# Altium project UltraZOhm_CarrierBoard.PrjPcb (part 3 of 8)

## Sheet ETH-PHY.SchDoc
size A4; Author: A. Geiger & E. Liegmann; CompanyName: Technische Hochschule Nürnberg Georg Simon Ohm; Organization: UltraZohm; Address1: Kesslerplatz 12; Address2: 90489 Nürnberg; Address3: GERMANY; SheetNumber: 30; Website: www.ultrazohm.com
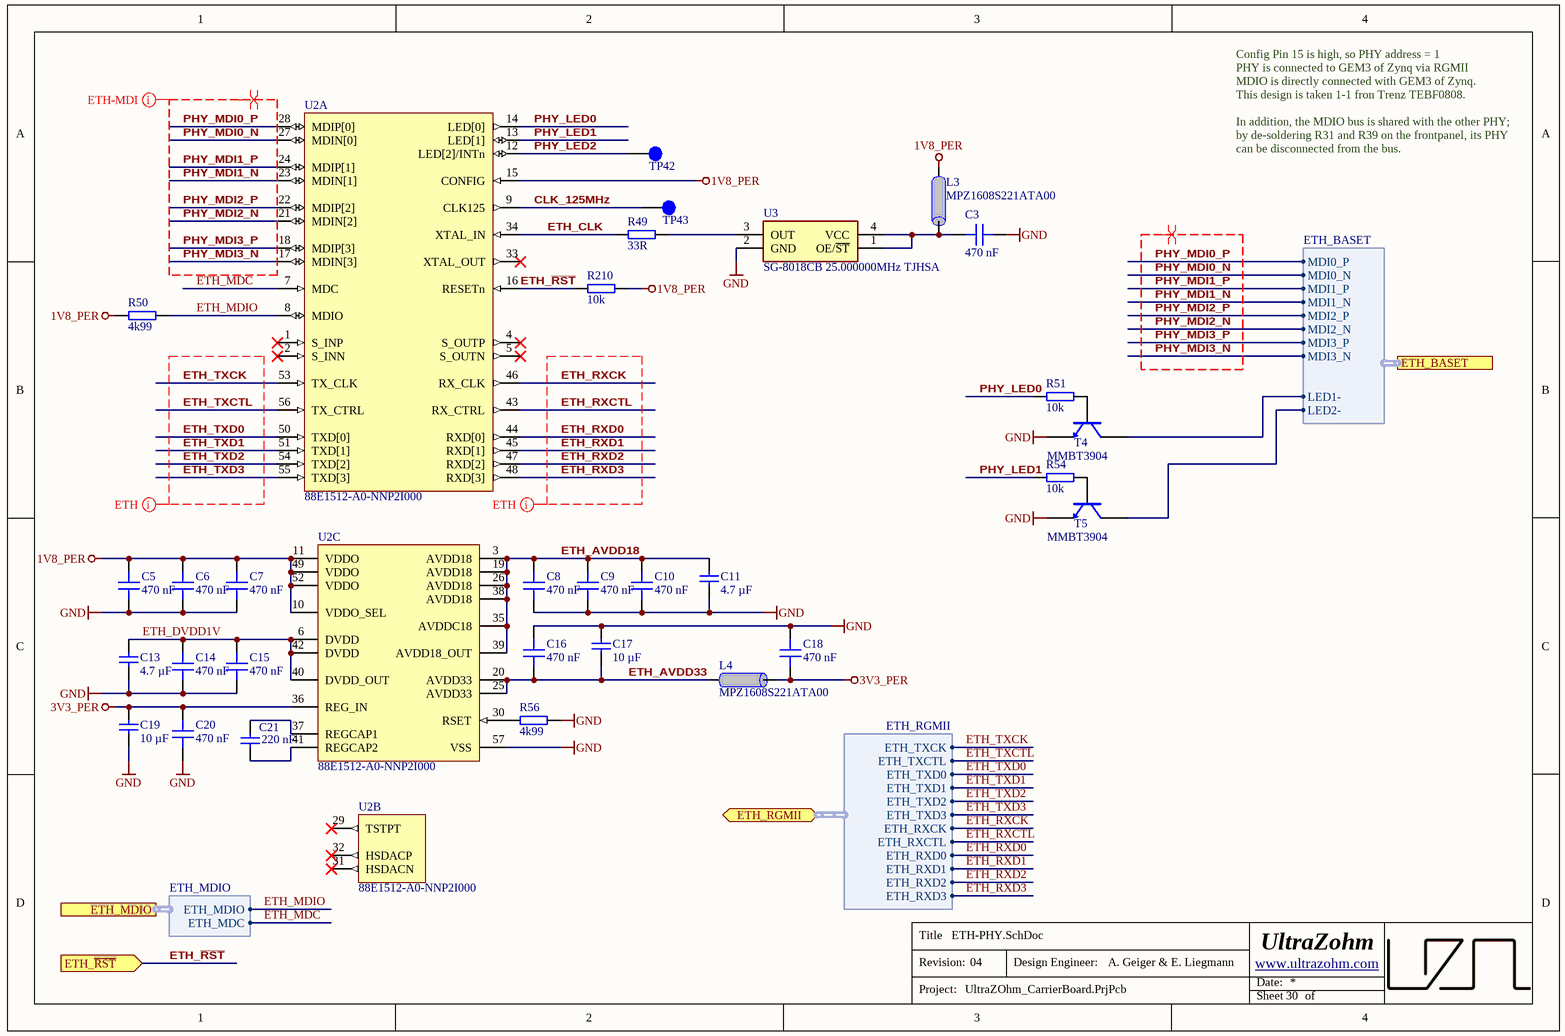
[diagram p5: ETH-PHY.SchDoc]

### Parts
C3  470 nF  [C_0603_TE]
C5  470 nF  [C_0603_TE]
C6  470 nF  [C_0603_TE]
C7  470 nF  [C_0603_TE]
C8  470 nF  [C_0603_TE]
C9  470 nF  [C_0603_TE]
C10  470 nF  [C_0603_TE]
C11  4.7 µF  [C_0603_TE]
C13  4.7 µF  [C_0603_TE]
C14  470 nF  [C_0603_TE]
C15  470 nF  [C_0603_TE]
C16  470 nF  [C_0603_TE]
C17  10 µF  [C_0603_TE]
C18  470 nF  [C_0603_TE]
C19  10 µF  [C_0603_TE]
C20  470 nF  [C_0603_TE]
C21  220 nF  [C_0603_TE]
L3  MPZ1608S221ATA00  [RES 0603_1608]
L4  MPZ1608S221ATA00  [RES 0603_1608]
R49  33R  [R_0603_TE]
R50  4k99  [RES 0603_1608]
R51  10k  [R_0603_TE]
R54  10k  [R_0603_TE]
R56  4k99  [RES 0603_1608]
R210  10k  [R_0603_TE]
T4  MMBT3904  [SOT95P280X145-3N]
T5  MMBT3904  [SOT95P280X145-3N]
TP42  Testpoint 1mm  [TP_1mm]  (value not drawn)  (no BOM)
TP43  Testpoint 1mm  [TP_1mm]  (value not drawn)  (no BOM)
U2  88E1512-A0-NNP2I000  [QFN50P800X800X100-57N]  (parts A,B,C of 3)
U3  SG-8018CB 25.000000MHz TJHSA  [SMD5032-4P]

### Ports
ETH_BASET (harness ETH_BASET), ETH_MDIO (harness ETH_MDIO), ETH_RGMII (bidir, harness ETH_RGMII), ETH_~{RST} (in)

### Harnesses
ETH_RGMII: ETH_TXCK, ETH_TXCTL, ETH_TXD0, ETH_TXD1, ETH_TXD2, ETH_TXD3, ETH_RXCK, ETH_RXCTL, ETH_RXD0, ETH_RXD1, ETH_RXD2, ETH_RXD3
ETH_MDIO: ETH_MDC, ETH_MDIO
ETH_BASET: MDI0_P, MDI0_N, MDI1_P, MDI1_N, MDI2_P, MDI2_N, MDI3_P, MDI3_N, LED1-, LED2-

### Nets
1V8_PER: C5.1 C6.1 C7.1 L3.1 R50.1 R210.2 U2.10(VDDO_SEL) U2.11(VDDO) U2.15(CONFIG) U2.49(VDDO) U2.52(VDDO)
3V3_PER: C18.2 C19.1 C20.1 L4.2 U2.36(REG_IN)
GND: C3.1 C5.2 C6.2 C7.2 C8.2 C9.2 C10.2 C11.2 C13.2 C14.2 C15.2 C16.1 C17.1 C18.1 C19.2 C20.2 R56.2 T4.2(EMITTER) T5.2(EMITTER) U2.57(VSS) U3.2(GND)
CLK_125MHz: TP43.1 U2.9(CLK125)
ETH_AVDD18: C8.1 C9.1 C10.1 C11.1 U2.3(AVDD18) U2.19(AVDD18) U2.26(AVDD18) U2.35(AVDDC18) U2.38(AVDD18) U2.39(AVDD18_OUT)
ETH_AVDD33: C16.2 C17.2 L4.1 U2.20(AVDD33) U2.25(AVDD33)
ETH_CLK: R49.1 U2.34(XTAL_IN)
ETH_DVDD1V: C13.1 C14.1 C15.1 U2.6(DVDD) U2.40(DVDD_OUT) U2.42(DVDD)
ETH_MDC: U2.7(MDC) ; port ETH_MDIO.ETH_MDC
ETH_MDIO: R50.2 U2.8(MDIO) ; port ETH_MDIO.ETH_MDIO
ETH_~{RST}: R210.1 U2.16(RESETn) ; port ETH_~{RST}  [project net Carrier_PG_1V8]
ETH_RXCK: U2.46(RX_CLK) ; port ETH_RGMII.ETH_RXCK
ETH_RXCTL: U2.43(RX_CTRL) ; port ETH_RGMII.ETH_RXCTL
ETH_RXD0: U2.44(RXD[0]) ; port ETH_RGMII.ETH_RXD0
ETH_RXD1: U2.45(RXD[1]) ; port ETH_RGMII.ETH_RXD1
ETH_RXD2: U2.47(RXD[2]) ; port ETH_RGMII.ETH_RXD2
ETH_RXD3: U2.48(RXD[3]) ; port ETH_RGMII.ETH_RXD3
ETH_TXCK: U2.53(TX_CLK) ; port ETH_RGMII.ETH_TXCK
ETH_TXCTL: U2.56(TX_CTRL) ; port ETH_RGMII.ETH_TXCTL
ETH_TXD0: U2.50(TXD[0]) ; port ETH_RGMII.ETH_TXD0
ETH_TXD1: U2.51(TXD[1]) ; port ETH_RGMII.ETH_TXD1
ETH_TXD2: U2.54(TXD[2]) ; port ETH_RGMII.ETH_TXD2
ETH_TXD3: U2.55(TXD[3]) ; port ETH_RGMII.ETH_TXD3
PHY_LED0: R51.1 U2.14(LED[0])
PHY_LED1: R54.1 U2.13(LED[1])
PHY_LED2: TP42.1 U2.12(LED[2]/INTn)
PHY_MDI0_N: U2.27(MDIN[0]) ; port ETH_BASET.MDI0_N
PHY_MDI0_P: U2.28(MDIP[0]) ; port ETH_BASET.MDI0_P
PHY_MDI1_N: U2.23(MDIN[1]) ; port ETH_BASET.MDI1_N
PHY_MDI1_P: U2.24(MDIP[1]) ; port ETH_BASET.MDI1_P
PHY_MDI2_N: U2.21(MDIN[2]) ; port ETH_BASET.MDI2_N
PHY_MDI2_P: U2.22(MDIP[2]) ; port ETH_BASET.MDI2_P
PHY_MDI3_N: U2.17(MDIN[3]) ; port ETH_BASET.MDI3_N
PHY_MDI3_P: U2.18(MDIP[3]) ; port ETH_BASET.MDI3_P
NetC3_2: C3.2 L3.2 U3.1(OE/~{ST}) U3.4(VCC)
NetC21_1: C21.1 U2.37(REGCAP1)
NetC21_2: C21.2 U2.41(REGCAP2)
NetR49_2: R49.2 U3.3(OUT)
NetR51_2: R51.2 T4.1(BASIS)
NetR54_2: R54.2 T5.1(BASIS)
NetR56_1: R56.1 U2.30(RSET)
NetT4_3: T4.3(COLLECTOR) ; port ETH_BASET.LED1-
NetT5_3: T5.3(COLLECTOR) ; port ETH_BASET.LED2-

Not connected (* = marked no-connect by the designer): U2 1(S_INP)* 2(S_INN)* 4(S_OUTP)* 5(S_OUTN)* 29(TSTPT)* 31(HSDACN)* 32(HSDACP)* 33(XTAL_OUT)*

### Layout directives
net class ETH: ETH_RXCK, ETH_RXCTL, ETH_RXD0, ETH_RXD1, ETH_RXD2, ETH_RXD3, ETH_TXCK, ETH_TXCTL, ETH_TXD0, ETH_TXD1, ETH_TXD2, ETH_TXD3
differential pair: PHY_MDI0_N, PHY_MDI0_P, PHY_MDI1_N, PHY_MDI1_P, PHY_MDI2_N, PHY_MDI2_P, PHY_MDI3_N, PHY_MDI3_P
net class ETH-MDI: PHY_MDI0_N, PHY_MDI0_P, PHY_MDI1_N, PHY_MDI1_P, PHY_MDI2_N, PHY_MDI2_P, PHY_MDI3_N, PHY_MDI3_P

### Notes on the sheet
- Config Pin 15 is high, so PHY address = 1
  PHY is connected to GEM3 of Zynq via RGMII
  MDIO is directly connected with GEM3 of Zynq.
  This design is taken 1-1 fron Trenz TEBF0808.
  In addition, the MDIO bus is shared with the other PHY; by de-soldering R31 and R39 on the frontpanel, its PHY can be disconnected from the bus.
- Title
- Revision:
- Design Engineer:
- Date:
- Project:
- Sheet
- of

### Library data of the parts
C3 C5-C10 C14-C16 C18 C20 = CL10A474KB8NNNC: Capacitor 0603, 50 VDC, 470 nF, X5R; Manufacturer: Samsung Electro-Mechanics; Tolerance: 10 %; Voltage Rating: 50 VDC; Created from: AGeiger; Value: 470 nF; Manufacturer Part Number: CL10A474KB8NNNC; PartID: 103; Created On: 22/08/2022 14:44:45; ComponentLink1Description: Datasheet; ComponentLink1URL: https://datasheet.lcsc.com/lcsc/1810191213_Samsung-Electro-Mechanics-CL10A474KB8NNNC_C170149.pdf; Component Type: Capacitor 0603; Device Package: 0603; Last Updated: 22/04/2025 15:48:45; Mounting Type: SMD; Operating Temperature: -55 - 85°C; Series: X5R; Supplier 1: LCSC; Supplier Part Number 1: C170149; Supplier 2: Mouser; Supplier Part Number 2: 187-CL10A474KB8NNNC; Type: Capacitor; Live Cycle Status: 1; LCSC Part Number: C170149
C11 C13 = UZgen_C_0603_4.7uF_16V_X5R: Generic capacitor; Manufacturer: UZgen; Tolerance: 10 %; Created from: MGeier; Voltage: 16V; Value: 4.7 µF; Manufacturer Part Number: UZgen_C_0603_4.7uF_16V_X5R; PartID: 5809; Created On: 20/03/2025 14:43:45; Device Package: 0603; Last Updated: 20/03/2025 14:43:45; Mounting Type: SMD; Technology: X5R
C17 C19 = UZgen_C_0603_10uF_6.3V_X7R: Generic capacitor; Manufacturer: UZgen; Tolerance: 10 %; Created from: UZgenTool; Voltage: 6.3V; Value: 10 µF; Manufacturer Part Number: UZgen_C_0603_10uF_6.3V_X7R; PartID: 3631; Created On: 02/08/2024 11:17:55; Device Package: 0603; Last Updated: 02/08/2024 11:17:55; Mounting Type: SMD; Technology: X7R
C21 = UZgen_C_0603_220nF_50V_X7R: Generic capacitor; Manufacturer: UZgen; Tolerance: 10 %; Voltage: 50V; Created from: UZgenTool; Value: 220 nF; Technology: X7R; Manufacturer Part Number: UZgen_C_0603_220nF_50V_X7R; PartID: 2; Created On: 02/07/2024 14:42:23; Device Package: 0603; Mounting Type: SMD; Last Updated: 08/08/2024 15:01:15
L3 L4 = MPZ1608S221ATA00: Ferritperle, 0603, 220 ohm, 2.2 A, Baureihe MPZ, 0.05 ohm, ± 25%; Manufacturer: TDK; Value: 220 Ohm; Type: Ferrite; DC current: 2.2 A; Created from: MGremer; Manufacturer Part Number: MPZ1608S221ATA00; PartID: 3; Created On: 08/06/2021 11:33:39; ComponentLink1Description: Datasheet; ComponentLink1URL: http://www.farnell.com/datasheets/2291439.pdf; Component Type: Ferritperle; Device Package: 0603; Last Updated: 12/07/2024 17:26:54; Mounting Type: SMD; Operating Temperature: -55 - 125 °C; Series: MPZ; Supplier 1: Farnell; Supplier Part Number 1: 1301677RL; Live Cycle Status: 1; LCSC Part Number: C76815; Stock number: not stored
R49 = UZgen_R_0603_33R: Generic resistor; Manufacturer: UZgen; Tolerance: 1 %; Created from: UZgenTool; Value: 33R; Manufacturer Part Number: UZgen_R_0603_33R; PartID: 185; Created On: 02/07/2024 17:29:48; Device Package: 0603; Mounting Type: SMD; Last Updated: 02/07/2024 17:29:48
R50 R56 = 0603WAF4991T5E: 1/10W Thick Film Resistors 75V ±1% ±100ppm/℃ -55℃~+155℃ 4.99kΩ 0603 Chip Resistor - Surface Mount ROHS; Manufacturer: UNI-ROYAL(Uniroyal Elec); Created from: NDiringer; Tolerance: 1%; Value: 4k99; Manufacturer Part Number: 0603WAF4991T5E; PartID: 230; Created On: 17/08/2022 08:08:34; ComponentLink1Description: Datasheet; ComponentLink1URL: https://datasheet.lcsc.com/lcsc/2206010116_UNI-ROYAL-Uniroyal-Elec-0603WAF4991T5E_C23046.pdf; Component Type: SMD resistor; Device Package: 0603; Last Updated: 17/08/2022 08:08:34; Mounting Type: SMD; Supplier 1: LCSC/JLCPCB; Supplier Part Number 1: C23046; Supplier 2: Mouser; Supplier Part Number 2: 303-0603WAF4991T5E; Type: Resistor; Live Cycle Status: 1; Stock number: not stored; LCSC Part Number: C23046
R51 R54 R210 = UZgen_R_0603_10k: Generic resistor; Manufacturer: UZgen; Tolerance: 1 %; Created from: AGeiger; Value: 10k; Manufacturer Part Number: UZgen_R_0603_10k; PartID: 1; Created On: 02/07/2024 14:34:53; Device Package: 0603; Mounting Type: SMD; Last Updated: 02/07/2024 14:37:16
T4 T5 = MMBT3904: Bipolartransistor, 40V 200mW 200mA 100@10mA,1V 300MHz 300mV@50mA,5mA NPN +150℃@(Tj) SOT-23(SOT-23-3); Manufacturer: Jiangsu Changjing Electronics Technology Co., Ltd.; Number Of Channels: single; Collector Basis Voltage: 60 V; Created from: NDiringer; Manufacturer Part Number: MMBT3904; PartID: 2; Created On: 10/06/2022 12:04:49; ComponentLink1Description: Datasheet; ComponentLink1URL: https://datasheet.lcsc.com/lcsc/1811011934_Jiangsu-Changjing-Electronics-Technology-Co---Ltd--MMBT3904_C20526.pdf; Component Type: Bipolartransistor; Device Package: SOT-23-3; Last Updated: 10/08/2022 13:48:16; Mounting Type: SMD; Operating Temperature: -55 - 150 °C; Series: MMBT3904; Supplier 1: Mouser; Supplier Part Number 1: MMBT3904; Supplier 2: LCSC/JLCPCB; Supplier Part Number 2: C20526; Type: Bipolartransistor; Collector Emitter Voltage: 40 V; Polarization: NPN; Power Dissipation: 200 mW; Value: 40 V; Live Cycle Status: 1; LCSC Part Number: C20526
TP42 TP43 = NULL: Manufacturer Part Number: NULL; Created from: AGeiger; Created: 2018_06_25_AGeiger; Value: Testpoint 1mm; PartID: 9; Created On: 20/09/2022 13:14:57; Component Type: Testpoint; Last Updated: 20/09/2022 13:15:39; Manufacturer: NULL; Supplier 1: NULL; Supplier Part Number 1: NULL; Type: Testpoint; Live Cycle Status: 1
U2 = 88E1512-A0-NNP2I000: Ethernet ICs Single-Port EEE GE PHY w/SGMII in 56-pin QFN; Manufacturer: Marvell; Created from: MGremer; Manufacturer Part Number: 88E1512-A0-NNP2I000; PartID: 1; Created On: 01/12/2020 16:21:41; ComponentLink1Description: Datasheet; ComponentLink1URL: https://www.mouser.de/datasheet/2/912/marvell-phys-transceivers-alaska-88e151x-datasheet-1360912.pdf; Component Type: Ethernet Single-Port; Device Package: QFN65; Last Updated: 26/06/2024 13:40:11; Mounting Type: SMD; Supplier 1: Mouser; Supplier Part Number 1: 348-88E1512A0NNP2I00; Type: Ethernet Single-Port; Live Cycle Status: 1; LCSC Part Number: C713256; Stock number: not stored
U3 = SG-8018CB 25.000000MHz TJHSA: ±50ppm 1.8V~3.3V 25MHz SMD5032-4P Programmable Oscillators ROHS; Manufacturer: Seiko Epson; Created from: FRosner; Value: 25 MHz; Manufacturer Part Number: SG-8018CB 25.000000MHz TJHSA; PartID: 3; Created On: 15/08/2024 10:38:39; ComponentLink1Description: Datasheet; ComponentLink1URL: https://download.epsondevice.com/td/pdf/app/SG-8018CB_en.pdf; Component Type: Oscillator; Device Package: 5032; Last Updated: 15/08/2024 10:38:39; Mounting Type: SMD; Operating Temperature: -40 to +105°C; Supplier 1: LCSC; Supplier Part Number 1: C390471; LCSC Part Number: C390471

## Sheet SD_Card.SchDoc
size A4; Author: A. Geiger & E. Liegmann; CompanyName: Technische Hochschule Nürnberg Georg Simon Ohm; Organization: UltraZohm; Address1: Kesslerplatz 12; Address2: 90489 Nürnberg; Address3: GERMANY; SheetNumber: 29; Website: www.ultrazohm.com
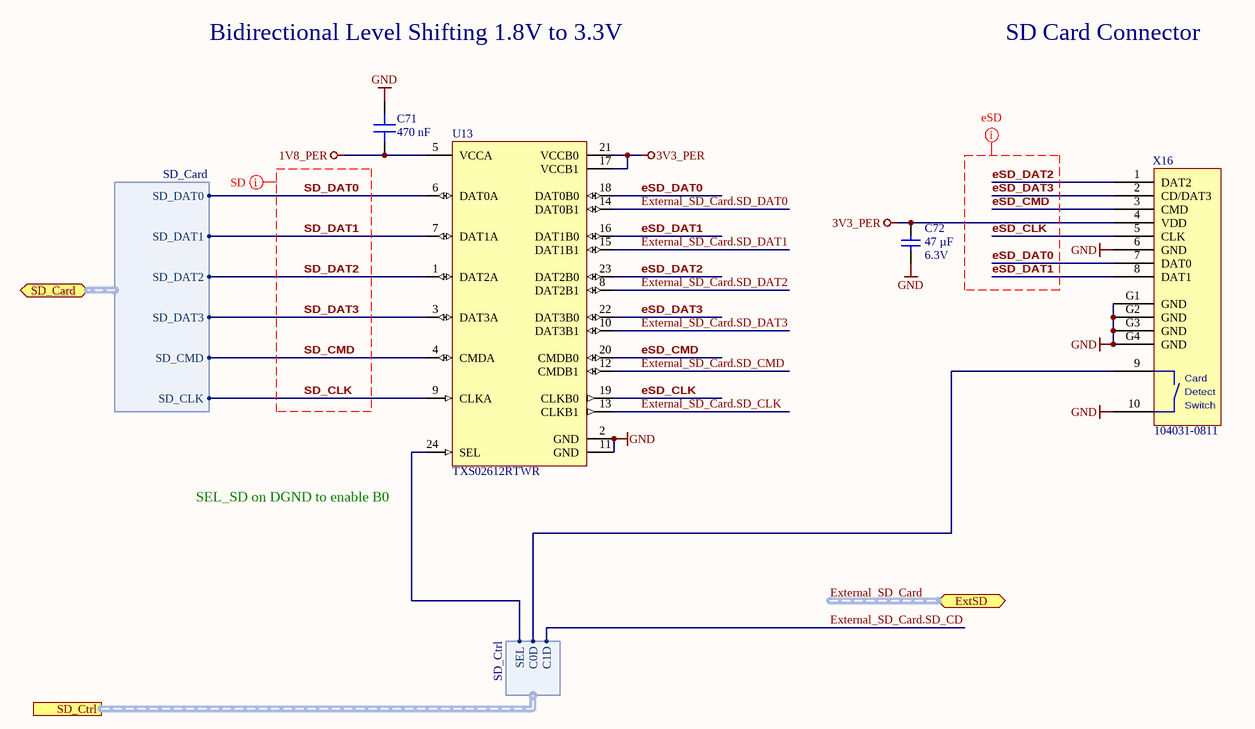
[diagram p6: SD_Card.SchDoc]

### Parts
C71  470 nF  [C_0603_TE]
C72  47 µF  Voltage: 6.3V  [C_0805_TE]
U13  TXS02612RTWR  [QFN50P400X400X80-25N-255]
X16  104031-0811  [104031-0811]

### Ports
ExtSD (bidir, harness ExtSD), SD_Card (bidir, harness SD_Card), SD_Ctrl (harness SD_CTRL)

### Harnesses
SD_Card: SD_DAT0, SD_DAT1, SD_DAT2, SD_DAT3, SD_CMD, SD_CLK
SD_Ctrl: SEL, C0D, C1D

### Nets
1V8_PER: C71.1 U13.5(VCCA)
3V3_PER: C72.2 U13.17(VCCB1) U13.21(VCCB0) X16.4(VDD)
GND: C71.2 C72.1 U13.2(GND) U13.11(GND) X16.6(GND) X16.10(CDSW) X16.G1(GND) X16.G2(GND) X16.G3(GND) X16.G4(GND)
eSD_CLK: U13.19(CLKB0) X16.5(CLK)
eSD_CMD: U13.20(CMDB0) X16.3(CMD)
eSD_DAT0: U13.18(DAT0B0) X16.7(DAT0)
eSD_DAT1: U13.16(DAT1B0) X16.8(DAT1)
eSD_DAT2: U13.23(DAT2B0) X16.1(DAT2)
eSD_DAT3: U13.22(DAT3B0) X16.2(CD/DAT3)
External_SD_Card.SD_CD: port SD_Ctrl.C1D
External_SD_Card.SD_CLK: U13.13(CLKB1)
External_SD_Card.SD_CMD: U13.12(CMDB1)
External_SD_Card.SD_DAT0: U13.14(DAT0B1)
External_SD_Card.SD_DAT1: U13.15(DAT1B1)
External_SD_Card.SD_DAT2: U13.8(DAT2B1)
External_SD_Card.SD_DAT3: U13.10(DAT3B1)
SD_CLK: U13.9(CLKA) ; port SD_Card.SD_CLK
SD_CMD: U13.4(CMDA) ; port SD_Card.SD_CMD
SD_DAT0: U13.6(DAT0A) ; port SD_Card.SD_DAT0
SD_DAT1: U13.7(DAT1A) ; port SD_Card.SD_DAT1
SD_DAT2: U13.1(DAT2A) ; port SD_Card.SD_DAT2
SD_DAT3: U13.3(DAT3A) ; port SD_Card.SD_DAT3
NetU13_24: U13.24(SEL) ; port SD_Ctrl.SEL
NetX16_9: X16.9(CDSW) ; port SD_Ctrl.C0D

### Buses and harness runs
harness External_SD_Card = port ExtSD

### Layout directives
net class eSD: eSD_CLK, eSD_CMD, eSD_DAT0, eSD_DAT1, eSD_DAT2, eSD_DAT3
net class SD: SD_CLK, SD_CMD, SD_DAT0, SD_DAT1, SD_DAT2, SD_DAT3

### Notes on the sheet
- Bidirectional Level Shifting 1.8V to 3.3V
- SD Card Connector
- SEL_SD on DGND to enable B0
- Title
- Revision:
- Design Engineer:
- Date:
- Project:
- Sheet
- of
- (in symbol 104031-0811) Card; Detect; Switch

### Library data of the parts
C71 = CL10A474KB8NNNC: Capacitor 0603, 50 VDC, 470 nF, X5R; Manufacturer: Samsung Electro-Mechanics; Tolerance: 10 %; Created from: AGeiger; Voltage Rating: 50 VDC; Value: 470 nF; Manufacturer Part Number: CL10A474KB8NNNC; PartID: 103; Created On: 22/08/2022 14:44:45; Device Package: 0603; Mounting Type: SMD; Last Updated: 22/04/2025 15:48:45; ComponentLink1Description: Datasheet; ComponentLink1URL: https://datasheet.lcsc.com/lcsc/1810191213_Samsung-Electro-Mechanics-CL10A474KB8NNNC_C170149.pdf; Component Type: Capacitor 0603; Operating Temperature: -55 - 85°C; Series: X5R; Supplier 1: LCSC; Supplier Part Number 1: C170149; Supplier 2: Mouser; Supplier Part Number 2: 187-CL10A474KB8NNNC; Type: Capacitor; Live Cycle Status: 1; LCSC Part Number: C170149
C72 = UZgen_C_0805_47uF_6.3V_X7R: Generic capacitor; Manufacturer: UZgen; Tolerance: 10 %; Created from: UZgenTool; Value: 47 µF; Technology: X7R; Manufacturer Part Number: UZgen_C_0805_47uF_6.3V_X7R; PartID: 5223; Created On: 02/08/2024 11:18:30; Device Package: 0805; Mounting Type: SMD; Last Updated: 02/08/2024 11:18:30
U13 = TXS02612RTWR: SDIO Port Expander with voltage level Translation; Manufacturer: Texas Instruments; Created from: MGremer; Manufacturer Part Number: TXS02612RTWR; PartID: 2; Created On: 01/12/2020 16:10:37; ComponentLink1Description: Datasheet; ComponentLink1URL: https://www.ti.com/lit/ds/sces682c/sces682c.pdf?ts=1606759646974&ref_url=https%253A%252F%252Fwww.google.com%252F; Component Type: Port Expander; Device Package: QFN; Last Updated: 04/09/2024 15:51:15; Mounting Type: QFN24; Supplier 1: Farnell; Supplier Part Number 1: 2335617RL; Supplier 2: Mouser; Supplier Part Number 2: 595-TXS02612RTWR; Supplier 3: Digi-Key; Supplier Part Number 3: 296-23869-1-ND; Type: Port Expander; Live Cycle Status: 1; Stock number: not stored; Supplier 4: LCSC; Supplier Part Number 4: C140276; LCSC Part Number: C140276
X16 = 104031-0811: microSD Memory Card Connector with detect switch; Manufacturer: Molex; Created from: MGremer; Manufacturer Part Number: 104031-0811; PartID: 1; Created On: 30/11/2020 14:53:05; ComponentLink1Description: Homepage; ComponentLink1URL: https://www.molex.com/molex/products/part-detail/memory_card_socket/1040310811; Component Type: SD Card Connector; Device Package: mircoSD; Last Updated: 09/07/2024 09:00:58; Mounting Type: SMD; Supplier 1: Farnell; Supplier Part Number 1: 2466891; Supplier 2: Mouser; Supplier Part Number 2: 538-104031-0811; Supplier 3: Digi-Key; Supplier Part Number 3: WM6357CT-ND; Supplier 4: LCSC; Supplier Part Number 4: C585350; Type: SD Card Connector; Live Cycle Status: 1; LCSC Part Number: C585350; Stock number: not stored

## Sheet Power_Supply_1.SchDoc
size A4; Author: A. Geiger & E. Liegmann; CompanyName: Technische Hochschule Nürnberg Georg Simon Ohm; Organization: UltraZohm; Address1: Kesslerplatz 12; Address2: 90489 Nürnberg; Address3: GERMANY; SheetNumber: 27; Website: www.ultrazohm.com
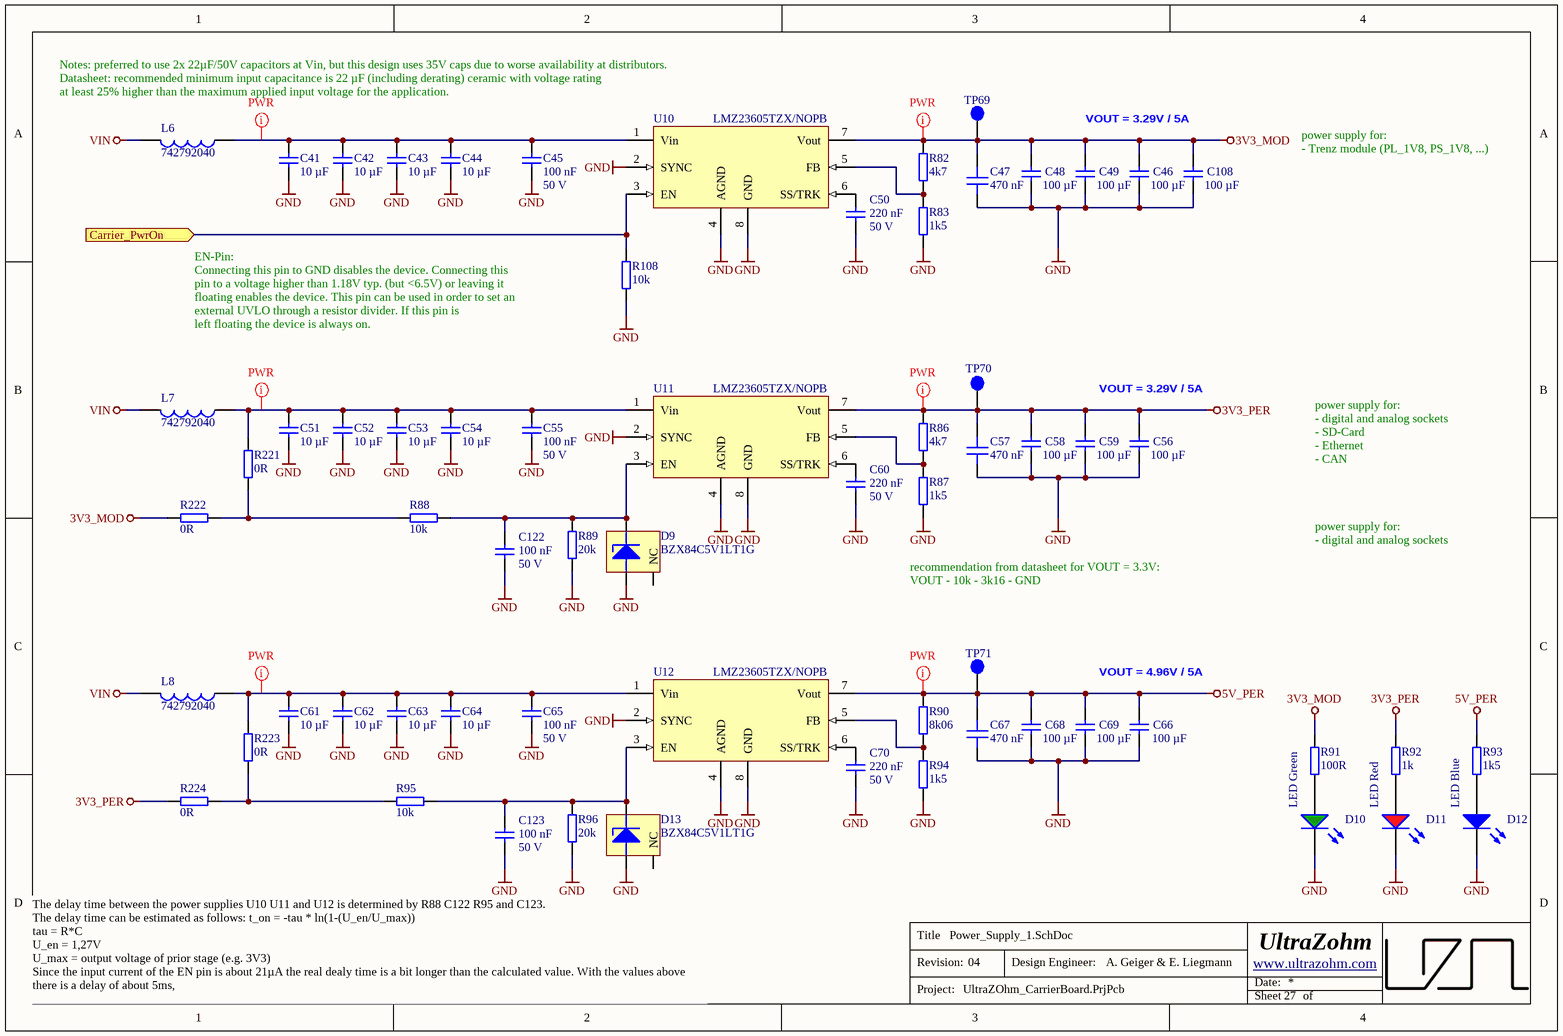
[diagram p7: Power_Supply_1.SchDoc]

### Parts
(Parts that share a designator on the sheet are numbered #1, #2 ... from top to bottom, then left to right.)
C41  10 µF  [C_1206_TE]
C42  10 µF  [C_1206_TE]
C43  10 µF  [C_1206_TE]
C44  10 µF  [C_1206_TE]
C45  100 nF  Voltage: 50 V  [C_0603_TE]
C46  100 µF  [C_1206_TE]
C47  470 nF  [C_0603_TE]
C48  100 µF  [C_1206_TE]
C49  100 µF  [C_1206_TE]
C50  220 nF  Voltage: 50 V  [C_0603_TE]
C51  10 µF  [C_1206_TE]
C52  10 µF  [C_1206_TE]
C53  10 µF  [C_1206_TE]
C54  10 µF  [C_1206_TE]
C55  100 nF  Voltage: 50 V  [C_0603_TE]
C56  100 µF  [C_1206_TE]
C57  470 nF  [C_0603_TE]
C58  100 µF  [C_1206_TE]
C59  100 µF  [C_1206_TE]
C60  220 nF  Voltage: 50 V  [C_0603_TE]
C61  10 µF  [C_1206_TE]
C62  10 µF  [C_1206_TE]
C63  10 µF  [C_1206_TE]
C64  10 µF  [C_1206_TE]
C65  100 nF  Voltage: 50 V  [C_0603_TE]
C66  100 µF  [C_1206_TE]
C67  470 nF  [C_0603_TE]
C68  100 µF  [C_1206_TE]
C69  100 µF  [C_1206_TE]
C70  220 nF  Voltage: 50 V  [C_0603_TE]
C108  100 µF  [C_1206_TE]
C122  100 nF  Voltage: 50 V  [C_0603_TE]
C123  100 nF  Voltage: 50 V  [C_0603_TE]
D9  BZX84C5V1LT1G  [SOT95P237X112-3N]
D10  LED Green  [WL-SMCW_0603]
D11  LED Red  [WL-SMCW_0603]
D12  LED Blue  [WL-SMCW_0603]
D13  BZX84C5V1LT1G  [SOT95P237X112-3N]
L6  742792040  [WE-CBF_0805_High Current]
L7  742792040  [WE-CBF_0805_High Current]
L8  742792040  [WE-CBF_0805_High Current]
R82  4k7  [R_0603_TE]
R83  1k5  [R_0603_TE]
R86  4k7  [R_0603_TE]
R87  1k5  [R_0603_TE]
R88  10k  [R_0603_TE]
R89  20k  [R_0603_TE]
R90  8k06  [R_0402_TE]
R91  100R  [R_0603_TE]
R92  1k  [R_0603_TE]
R93  1k5  [R_0603_TE]
R94  1k5  [R_0603_TE]
R95  10k  [R_0603_TE]
R96  20k  [R_0603_TE]
R108#1  10k  [R_0603_TE]
R221  0R  [R_1206_TE]
R222  0R  [R_1206_TE]
R223  0R  [R_1206_TE]
R224  0R  [R_1206_TE]
TP69  Testpoint 1mm  [TP_1mm]  (value not drawn)  (no BOM)
TP70  Testpoint 1mm  [TP_1mm]  (value not drawn)  (no BOM)
TP71  Testpoint 1mm  [TP_1mm]  (value not drawn)  (no BOM)
U10  LMZ23605TZX/NOPB  [7TO-PMOD]
U11  LMZ23605TZX/NOPB  [7TO-PMOD]
U12  LMZ23605TZX/NOPB  [7TO-PMOD]

### Ports
Carrier_PwrOn (in)

### Nets
3V3_MOD: C46.1 C47.1 C48.1 C49.1 C108.1 R82.2 R91.2 R222.2 TP69.1 U10.7(Vout)
3V3_PER: C56.1 C57.1 C58.1 C59.1 R86.2 R92.2 R224.2 TP70.1 U11.7(Vout)
5V_PER: C66.1 C67.1 C68.1 C69.1 R90.1 R93.2 TP71.1 U12.7(Vout)
GND: C41.2 C42.2 C43.2 C44.2 C45.1 C46.2 C47.2 C48.2 C49.2 C50.2 C51.2 C52.2 C53.2 C54.2 C55.1 C56.2 C57.2 C58.2 C59.2 C60.2 C61.2 C62.2 C63.2 C64.2 C65.1 C66.2 C67.2 C68.2 C69.2 C70.2 C108.2 C122.2 C123.2 D9.1(ANODE) D10.1(K) D11.1(K) D12.1(K) D13.1(ANODE) R83.1 R87.1 R89.1 R94.2 R96.1 R108#1.1 U10.2(SYNC) U10.4(AGND) U10.8(GND) U11.2(SYNC) U11.4(AGND) U11.8(GND) U12.2(SYNC) U12.4(AGND) U12.8(GND)
VIN: L6.2 L7.2 L8.2
Carrier_PwrOn: R108#1.2 U10.3(EN) ; port Carrier_PwrOn
NetC41_1: C41.1 C42.1 C43.1 C44.1 C45.2 L6.1 U10.1(Vin)
NetC50_1: C50.1 U10.6(SS/TRK)
NetC51_1: C51.1 C52.1 C53.1 C54.1 C55.2 L7.1 R221.2 U11.1(Vin)
NetC60_1: C60.1 U11.6(SS/TRK)
NetC61_1: C61.1 C62.1 C63.1 C64.1 C65.2 L8.1 R223.2 U12.1(Vin)
NetC70_1: C70.1 U12.6(SS/TRK)
NetC122_1: C122.1 D9.3(KATHODE) R88.2 R89.2 U11.3(EN)
NetC123_1: C123.1 D13.3(KATHODE) R95.2 R96.2 U12.3(EN)
NetD10_2: D10.2(A) R91.1
NetD11_2: D11.2(A) R92.1
NetD12_2: D12.2(A) R93.1
NetR82_1: R82.1 R83.2 U10.5(FB)
NetR86_1: R86.1 R87.2 U11.5(FB)
NetR88_1: R88.1 R221.1 R222.1
NetR90_2: R90.2 R94.1 U12.5(FB)
NetR95_1: R95.1 R223.1 R224.1

Not connected (* = marked no-connect by the designer): D9 2(NC); D13 2(NC)

### Layout directives
net class PWR: 3V3_MOD, 3V3_PER, 5V_PER, NetC41_1, NetC51_1, NetC61_1

### Notes on the sheet
- Notes: preferred to use 2x 22µF/50V capacitors at Vin, but this design uses 35V caps due to worse availability at distributors.
- Datasheet: recommended minimum input capacitance is 22 µF (including derating) ceramic with voltage rating
- at least 25% higher than the maximum applied input voltage for the application.
- VOUT = 3.29V / 5A
- power supply for:
  - Trenz module (PL_1V8, PS_1V8, ...)
- EN-Pin:
  Connecting this pin to GND disables the device. Connecting this pin to a voltage higher than 1.18V typ. (but <6.5V) or leaving it floating enables the device. This pin can be used in order to set an external UVLO through a resistor divider. If this pin is
  left floating the device is always on.
- power supply for:
  - digital and analog sockets
  - SD-Card
  - Ethernet
  - CAN
- power supply for:
  - digital and analog sockets
- recommendation from datasheet for VOUT = 3.3V:
  VOUT - 10k - 3k16 - GND
- VOUT = 4.96V / 5A
- The delay time between the power supplies U10 U11 and U12 is determined by R88 C122 R95 and C123.
  The delay time can be estimated as follows: t_on = -tau * ln(1-(U_en/U_max))
  tau = R*C
  U_en = 1,27V
  U_max = output voltage of prior stage (e.g. 3V3)
  Since the input current of the EN pin is about 21µA the real dealy time is a bit longer than the calculated value. With the values above there is a delay of about 5ms,
- Title
- Revision:
- Design Engineer:
- Date:
- Project:
- Sheet
- of

### Library data of the parts
C41-C44 C51-C54 C61-C64 = UZgen_C_1206_10uF_50V_X7R: Generic capacitor; Manufacturer: UZgen; Tolerance: 10 %; Created from: MGeier; Voltage: 50V; Value: 10 µF; Manufacturer Part Number: UZgen_C_1206_10uF_50V_X7R; PartID: 5807; Created On: 20/03/2025 14:05:00; Device Package: 1206; Last Updated: 20/03/2025 14:05:00; Mounting Type: SMD; Technology: X7R
C45 C55 C65 C122 C123 = UZgen_C_0603_100nF_50V_X7R: Generic capacitor; Manufacturer: UZgen; Tolerance: 10 %; Created from: AGeiger; Value: 100 nF; Technology: X7R; Manufacturer Part Number: UZgen_C_0603_100nF_50V_X7R; PartID: 1; Created On: 02/07/2024 14:42:23; Device Package: 0603; Mounting Type: SMD; Last Updated: 02/08/2024 14:45:57
C46 C48 C49 C56 C58 C59 C66 C68 C69 C108 = CL31A107MQHNNNE: 6.3V 100uF X5R ±20% 1206 Multilayer Ceramic Capacitors MLCC; Manufacturer: Samsung Electro-Mechanics; Created from: MGeier; Tolerance: 20%; Value: 100 µF; Manufacturer Part Number: CL31A107MQHNNNE; PartID: 152; Created On: 02/08/2024 16:00:00; ComponentLink1Description: Datasheet; ComponentLink1URL: https://wmsc.lcsc.com/wmsc/upload/file/pdf/v2/lcsc/2304140030_Samsung-Electro-Mechanics-CL31A107MQHNNNE_C15008.pdf; Component Type: Capacitor 1206; Device Package: 1206; Last Updated: 02/08/2024 16:00:00; Mounting Type: SMD; Operating Temperature: -55 - 85°C; Series: CL; Supplier 1: LCSC; Supplier Part Number 1: C15008; Type: Capacitor; Voltage Rating: 6.3 V; Live Cycle Status: 1; LCSC Part Number: C15008; Stock number: not stored
C47 C57 C67 = CL10A474KB8NNNC: as C71 on sheet SD_Card; Value: 470 nF; Manufacturer Part Number: CL10A474KB8NNNC; PartID: 103; Created On: 22/08/2022 14:44:45; Device Package: 0603; Mounting Type: SMD; Last Updated: 22/04/2025 15:48:45; ComponentLink1Description: Datasheet; ComponentLink1URL: https://datasheet.lcsc.com/lcsc/1810191213_Samsung-Electro-Mechanics-CL10A474KB8NNNC_C170149.pdf; Component Type: Capacitor 0603; Operating Temperature: -55 - 85°C; Series: X5R; Supplier 1: LCSC; Supplier Part Number 1: C170149; Supplier 2: Mouser; Supplier Part Number 2: 187-CL10A474KB8NNNC; Type: Capacitor; Live Cycle Status: 1; LCSC Part Number: C170149
C50 C60 C70 = UZgen_C_0603_220nF_50V_X7R: Generic capacitor; Manufacturer: UZgen; Tolerance: 10 %; Created from: UZgenTool; Value: 220 nF; Technology: X7R; Manufacturer Part Number: UZgen_C_0603_220nF_50V_X7R; PartID: 2; Created On: 02/07/2024 14:42:23; Device Package: 0603; Mounting Type: SMD; Last Updated: 02/08/2024 14:45:57
D9 D13 = 30827: Zener Diode 5.1V 6% 225mW; AN: 30827; Mixed: SMT; Temperature-Range: -65/+150 (Tj Abs); Case: SOT23-3; Voltage: 5.1V; HelpURL: b:\AD\adlib\datasheet\ON_Semiconductor\BZX84CxxxLT1G\; H-ART: BZX84C5V1LT1G; Storage-Temperature: -65/+150 (Tj Abs)
D10 = UZgen_LED_0603_Green: Standard LEDs - SMD 0603 green; Manufacturer: UZgen; Created from: UZgenTool; Manufacturer Part Number: UZgen_LED_0603_Green; PartID: 21; Created On: 09/09/2024 10:45:01; ComponentLink1Description: N/A; ComponentLink1URL: N/A; Component Type: LED Diode; Device Package: 0603; Last Updated: 09/09/2024 10:45:01; Mounting Type: SMD; Supplier 1: LCSC; Supplier Part Number 1: =LCSC Part Number; Type: Standard; Live Cycle Status: 1; Stock number: not stored; Color: green; Value: LED Green
D11 = UZgen_LED_0603_Red: Standard LEDs - SMD 0603 red; Manufacturer: UZgen; Created from: UZgenTool; Manufacturer Part Number: UZgen_LED_0603_Red; PartID: 22; Created On: 09/09/2024 10:45:01; ComponentLink1Description: N/A; ComponentLink1URL: N/A; Component Type: LED Diode; Device Package: 0603; Last Updated: 09/09/2024 10:45:01; Mounting Type: SMD; Supplier 1: LCSC; Supplier Part Number 1: =LCSC Part Number; Type: Standard; Live Cycle Status: 1; Stock number: not stored; Color: red; Value: LED Red
D12 = UZgen_LED_0603_Blue: Standard LEDs - SMD 0603 blue; Manufacturer: UZgen; Created from: UZgenTool; Manufacturer Part Number: UZgen_LED_0603_Blue; PartID: 20; Created On: 09/09/2024 10:45:01; ComponentLink1Description: N/A; ComponentLink1URL: N/A; Component Type: LED Diode; Device Package: 0603; Last Updated: 09/09/2024 10:45:01; Mounting Type: SMD; Supplier 1: LCSC; Supplier Part Number 1: =LCSC Part Number; Type: Standard; Live Cycle Status: 1; Stock number: not stored; Color: blue; Value: LED Blue
L6-L8 = 742792040: Inductance, 0805, 100 MHz, 600 Ohm, 2 A; Manufacturer: Wuerth Elektronik; Type: Inductance SMD; DC current: 2 A; Value: 600 Ohm; Created from: AGeiger; Manufacturer Part Number: 742792040; PartID: 1; Created On: 18/01/2021 14:53:17; ComponentLink1Description: Datasheet; ComponentLink1URL: https://www.mouser.de/datasheet/2/445/742792040-1720361.pdf; Component Type: Inductance; Device Package: 0805; Last Updated: 22/08/2024 07:43:45; Mounting Type: SMD; Operating Temperature: -55 - 125 °C; Series: WE-CBF; Supplier 1: Mouser; Supplier Part Number 1: 710-742792040; Live Cycle Status: 1; LCSC Part Number: C2661857; Stock number: not stored
R82 R86 = UZgen_R_0603_4k7: Generic resistor; Manufacturer: UZgen; Tolerance: 1 %; Created from: UZgenTool; Value: 4k7; Manufacturer Part Number: UZgen_R_0603_4k7; PartID: 237; Created On: 02.07.2024 17:29:50; Device Package: 0603; Mounting Type: SMD; Last Updated: 02.07.2024 17:29:50
R83 R87 R93 R94 = UZgen_R_0603_1k5: Generic resistor; Manufacturer: UZgen; Tolerance: 1 %; Created from: UZgenTool; Value: 1k5; Manufacturer Part Number: UZgen_R_0603_1k5; PartID: 225; Created On: 02.07.2024 17:29:49; Device Package: 0603; Mounting Type: SMD; Last Updated: 02.07.2024 17:29:49
R88 R95 R108#1 = UZgen_R_0603_10k: as R51 on sheet ETH-PHY; Value: 10k; Manufacturer Part Number: UZgen_R_0603_10k; PartID: 1; Created On: 02/07/2024 14:34:53; Device Package: 0603; Mounting Type: SMD; Last Updated: 02/07/2024 14:37:16
R89 R96 = UZgen_R_0603_20k: Generic resistor; Manufacturer: UZgen; Tolerance: 1 %; Created from: UZgenTool; Value: 20k; Manufacturer Part Number: UZgen_R_0603_20k; PartID: 251; Created On: 02.07.2024 17:29:50; Device Package: 0603; Mounting Type: SMD; Last Updated: 02.07.2024 17:29:50
R90 = UZgen_R_0402_8k06: Non generic resistor; Manufacturer: UZgen; Tolerance: 1 %; Created from: UZgenTool; Value: 8k06; Manufacturer Part Number: UZgen_R_0402_8k06; PartID: 584; Created On: 08.07.2024 14:34:30; Device Package: 0402; Mounting Type: SMD; Last Updated: 08.07.2024 14:34:30
R91 = UZgen_R_0603_100R: Generic resistor; Manufacturer: UZgen; Tolerance: 1 %; Created from: UZgenTool; Value: 100R; Manufacturer Part Number: UZgen_R_0603_100R; PartID: 197; Created On: 02.07.2024 17:29:48; Device Package: 0603; Mounting Type: SMD; Last Updated: 02.07.2024 17:29:48
R92 = UZgen_R_0603_1k: Generic resistor; Manufacturer: UZgen; Tolerance: 1 %; Created from: UZgenTool; Value: 1k; Manufacturer Part Number: UZgen_R_0603_1k; PartID: 221; Created On: 02.07.2024 17:29:49; Device Package: 0603; Mounting Type: SMD; Last Updated: 02.07.2024 17:29:49
R221-R224 = UZgen_R_1206_0R: Generic resistor; Manufacturer: UZgen; Tolerance: 1 %; Created from: UZgenTool; Value: 0R; Manufacturer Part Number: UZgen_R_1206_0R; PartID: 583; Created On: 08/07/2024 14:34:30; Device Package: 1206; Mounting Type: SMD; Last Updated: 08/07/2024 14:34:30
TP69-TP71 = 25063: AN: 25063; Mixed: SMT
U10-U12 = LMZ23605TZX/NOPB: Switching Voltage Regulators Gen2 36Vin 5A Module; Manufacturer: Texas Instruments; Created from: FRosner; Manufacturer Part Number: LMZ23605TZX/NOPB; PartID: 8; Created On: 28/06/2024 11:02:49; ComponentLink1Description: Datasheet; ComponentLink1URL: https://www.ti.com/lit/ds/symlink/lmz23605.pdf; Component Type: DC-DC Converters ROHS; Device Package: TO-PMOD-7; Last Updated: 06/08/2024 16:10:42; Mounting Type: SMD; Operating Temperature: -40 - 85 °C; Supplier 1: LCSC; Supplier Part Number 1: C913851; Type: Switching Voltage Regulators; Live Cycle Status: 1; LCSC Part Number: C913851; Stock number: not stored

## Sheet Power_Supply_2.SchDoc
size A4; Author: A. Geiger & E. Liegmann; CompanyName: Technische Hochschule Nürnberg Georg Simon Ohm; Organization: UltraZohm; Address1: Kesslerplatz 12; Address2: 90489 Nürnberg; Address3: GERMANY; SheetNumber: 28; Website: www.ultrazohm.com
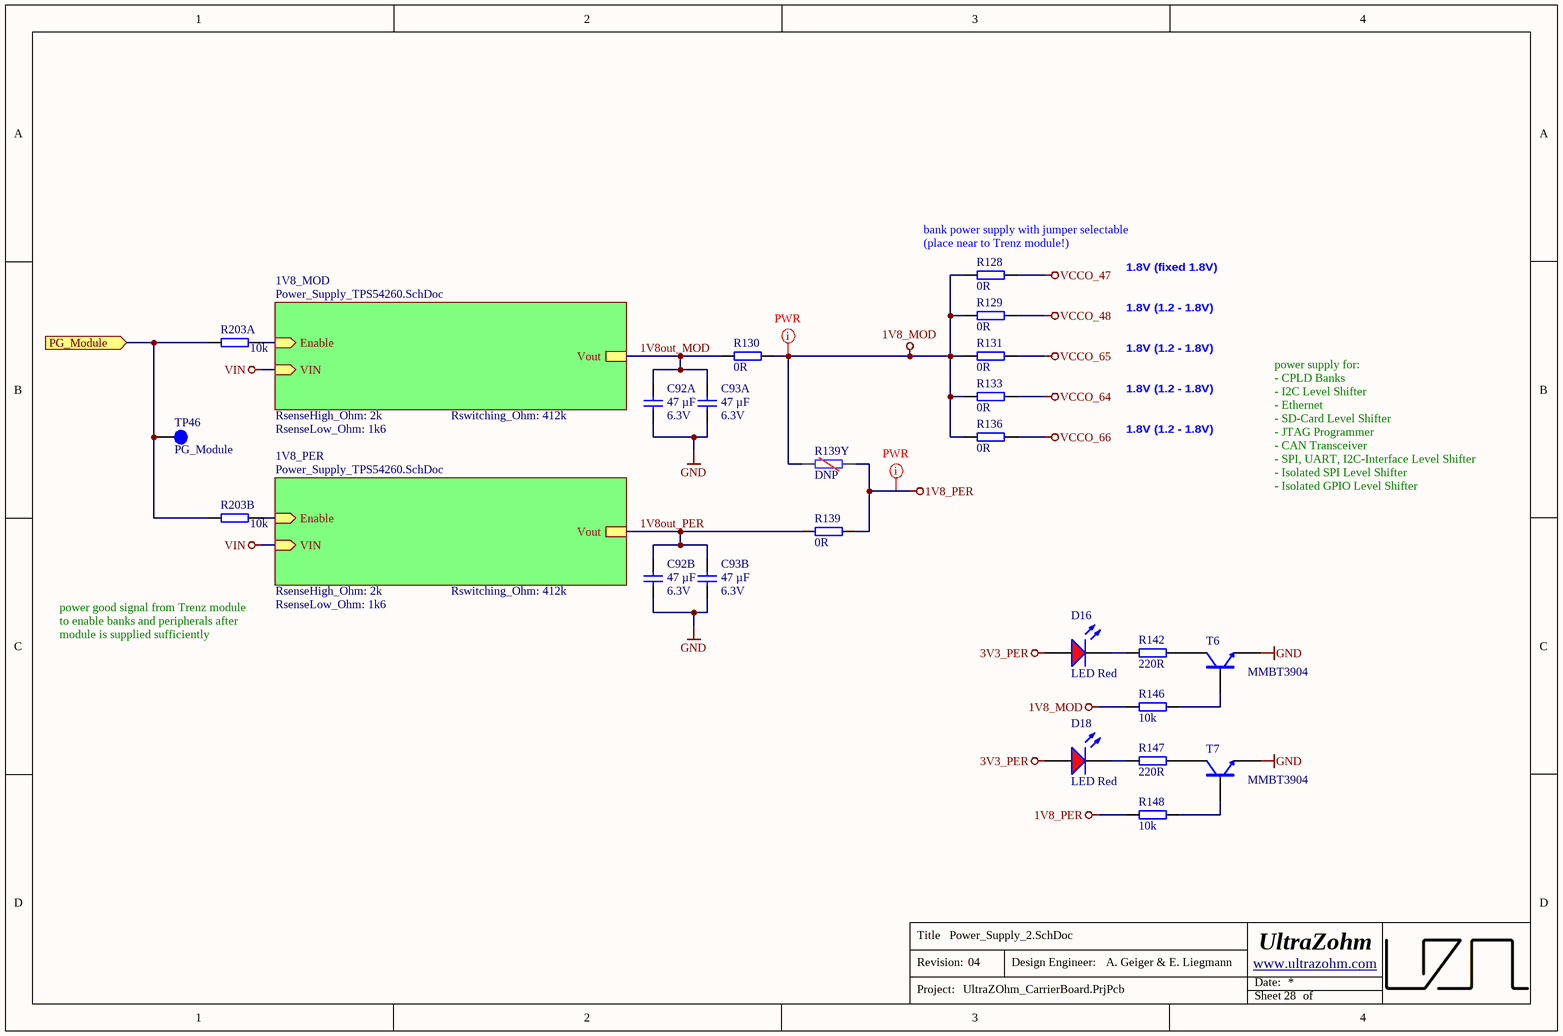
[diagram p8: Power_Supply_2.SchDoc]

### Parts
C92A  47 µF  Voltage: 6.3V  [C_0805_TE]
C92B  47 µF  Voltage: 6.3V  [C_0805_TE]
C93A  47 µF  Voltage: 6.3V  [C_0805_TE]
C93B  47 µF  Voltage: 6.3V  [C_0805_TE]
D16  LED Red  [WL-SMCW_0603]
D18  LED Red  [WL-SMCW_0603]
R128  0R  [R_1206_TE]
R129  0R  [R_1206_TE]
R130  0R  [R_1206_TE]
R131  0R  [R_1206_TE]
R133  0R  [R_1206_TE]
R136  0R  [R_1206_TE]
R139  0R  [R_1206_TE]
R139Y  DNP  [R_1206_TE-DNP]  (no BOM)
R142  220R  [R_0603_TE]
R146  10k  [R_0603_TE]
R147  220R  [R_0603_TE]
R148  10k  [R_0603_TE]
R203A  10k  [R_0603_TE]
R203B  10k  [R_0603_TE]
T6  MMBT3904  [SOT95P280X145-3N]
T7  MMBT3904  [SOT95P280X145-3N]
TP46  PG_Module  [TP_1mm]  (no BOM)

### Sub-sheets
1V8_MOD = Power_Supply_TPS54260.SchDoc (file not in this document): Vout, Enable (in), VIN (in)  | RsenseHigh_Ohm: 2k; RsenseLow_Ohm: 1k6; Rswitching_Ohm: 412k; SubSheet_SheetNumber: 28.1; Output_V: 1.8
1V8_PER = Power_Supply_TPS54260.SchDoc (file not in this document): Vout, Enable (in), VIN (in)  | RsenseHigh_Ohm: 2k; RsenseLow_Ohm: 1k6; Rswitching_Ohm: 412k; SubSheet_SheetNumber: 28.2; Output_V: 1.8

### Ports
PG_Module (in)

### Nets
1V8_MOD: R128.1 R129.1 R130.2 R131.1 R133.1 R136.1 R139Y.1 R146.1
1V8_PER: R139.2 R139Y.2 R148.1
3V3_PER: D16.2(A) D18.2(A)
GND: C92A.1 C92B.1 C93A.1 C93B.1 T6.2(EMITTER) T7.2(EMITTER)
VCCO_47: R128.2
VCCO_48: R129.2
VCCO_64: R133.2
VCCO_65: R131.2
VCCO_66: R136.2
VIN: sheet 1V8_PER/VIN, sheet 1V8_MOD/VIN
1V8out_MOD: C92A.2 C93A.2 R130.1 ; sheet 1V8_MOD/Vout
1V8out_PER: C92B.2 C93B.2 R139.1 ; sheet 1V8_PER/Vout
PG_Module: R203A.1 R203B.1 TP46.1 ; port PG_Module
NetD16_1: D16.1(K) R142.1
NetD18_1: D18.1(K) R147.1
NetR142_2: R142.2 T6.3(COLLECTOR)
NetR146_2: R146.2 T6.1(BASIS)
NetR147_2: R147.2 T7.3(COLLECTOR)
NetR148_2: R148.2 T7.1(BASIS)
NetR203A_2: R203A.2 ; sheet 1V8_MOD/Enable
NetR203B_2: R203B.2 ; sheet 1V8_PER/Enable

### Layout directives
net class PWR: 1V8_MOD, 1V8_PER

### Notes on the sheet
- (near R128) bank power supply with jumper selectable
  (place near to Trenz module!)
- 1.8V (fixed 1.8V)
- 1.8V (1.2 - 1.8V)
- power supply for:
  - CPLD Banks
  - I2C Level Shifter
  - Ethernet
  - SD-Card Level Shifter
  - JTAG Programmer
  - CAN Transceiver
  - SPI, UART, I2C-Interface Level Shifter
  - Isolated SPI Level Shifter
  - Isolated GPIO Level Shifter
- power good signal from Trenz module to enable banks and peripherals after module is supplied sufficiently
- Title
- Revision:
- Design Engineer:
- Date:
- Project:
- Sheet
- of

### Library data of the parts
C92A C92B C93A C93B = UZgen_C_0805_47uF_6.3V_X7R: as C72 on sheet SD_Card; Value: 47 µF; Technology: X7R; Manufacturer Part Number: UZgen_C_0805_47uF_6.3V_X7R; PartID: 5223; Created On: 02/08/2024 11:18:30; Device Package: 0805; Mounting Type: SMD; Last Updated: 02/08/2024 11:18:30
D16 D18 = UZgen_LED_0603_Red: as D11 on sheet Power_Supply_1; Manufacturer Part Number: UZgen_LED_0603_Red; PartID: 22; Created On: 09/09/2024 10:45:01; ComponentLink1Description: N/A; ComponentLink1URL: N/A; Component Type: LED Diode; Device Package: 0603; Last Updated: 09/09/2024 10:45:01; Mounting Type: SMD; Supplier 1: LCSC; Supplier Part Number 1: =LCSC Part Number; Type: Standard; Live Cycle Status: 1; Stock number: not stored; Color: red; Value: LED Red
R128-R131 R133 R136 R139 = UZgen_R_1206_0R: as R221-R224 on sheet Power_Supply_1; Value: 0R; Manufacturer Part Number: UZgen_R_1206_0R; PartID: 583; Created On: 08.07.2024 14:34:30; Device Package: 1206; Mounting Type: SMD; Last Updated: 08.07.2024 14:34:30
R139Y = UZgen_R_1206_DNP: Generic resistor (DNP); Manufacturer: UZgen; Created from: UZgenTool; Value: DNP; Tolerance: -; Manufacturer Part Number: UZgen_R_1206_DNP; PartID: 595; Created On: 25/03/2025 14:26:15; Device Package: 1206; Mounting Type: SMD; Last Updated: 02/04/2025 19:05:00
R142 R147 = UZgen_R_0603_220R: Generic resistor; Manufacturer: UZgen; Tolerance: 1 %; Created from: UZgenTool; Value: 220R; Manufacturer Part Number: UZgen_R_0603_220R; PartID: 205; Created On: 02.07.2024 17:29:49; Device Package: 0603; Mounting Type: SMD; Last Updated: 02.07.2024 17:29:49
R146 R148 R203A R203B = UZgen_R_0603_10k: as R51 on sheet ETH-PHY; Value: 10k; Manufacturer Part Number: UZgen_R_0603_10k; PartID: 1; Created On: 02.07.2024 14:34:53; Device Package: 0603; Mounting Type: SMD; Last Updated: 02.07.2024 14:37:16
T6 T7 = MMBT3904: as T4 on sheet ETH-PHY; Manufacturer Part Number: MMBT3904; PartID: 2; Created On: 10.06.2022 12:04:49; ComponentLink1Description: Datasheet; ComponentLink1URL: https://datasheet.lcsc.com/lcsc/1811011934_Jiangsu-Changjing-Electronics-Technology-Co---Ltd--MMBT3904_C20526.pdf; Component Type: Bipolartransistor; Device Package: SOT-23-3; Last Updated: 10.08.2022 13:48:16; Mounting Type: SMD; Operating Temperature: -55 - 150 °C; Series: MMBT3904; Supplier 1: Mouser; Supplier Part Number 1: MMBT3904; Supplier 2: LCSC/JLCPCB; Supplier Part Number 2: C20526; Type: Bipolartransistor; Collector Emitter Voltage: 40 V; Polarization: NPN; Power Dissipation: 200 mW; Value: 40 V; Live Cycle Status: 1; LCSC Part Number: C20526
TP46 = NULL: Testpoint 1mm; Manufacturer Part Number: NULL; Created from: AGeiger; Created: 2018_06_25_AGeiger; Value: PG_Module; PartID: 9; Created On: 20/09/2022 13:14:57; Component Type: Testpoint; Last Updated: 20/09/2022 13:15:39; Manufacturer: NULL; Supplier 1: NULL; Supplier Part Number 1: NULL; Type: Testpoint; Live Cycle Status: 1

## Sheet Power_Supply_Input.SchDoc
size A4; Author: A. Geiger & E. Liegmann; CompanyName: Technische Hochschule Nürnberg Georg Simon Ohm; Organization: UltraZohm; Address1: Kesslerplatz 12; Address2: 90489 Nürnberg; Address3: GERMANY; SheetNumber: 23; Website: www.ultrazohm.com
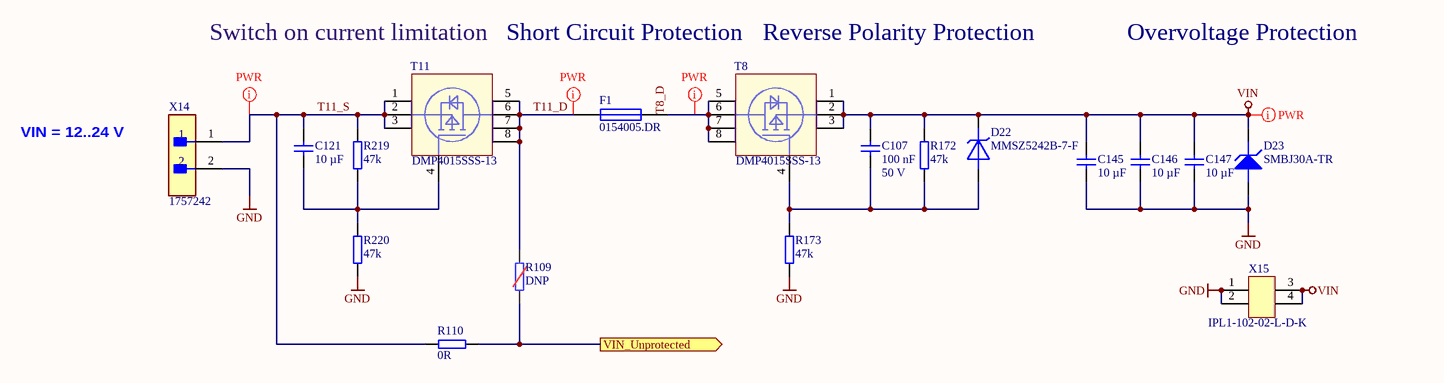
[diagram p9: Power_Supply_Input.SchDoc]

### Parts
(Parts that share a designator on the sheet are numbered #1, #2 ... from top to bottom, then left to right.)
C107  100 nF  Voltage: 50 V  [C_0603_TE]
C121  10 µF  [C_1206_TE]
C145  10 µF  [C_1206_TE]
C146  10 µF  [C_1206_TE]
C147  10 µF  [C_1206_TE]
D22  MMSZ5242B-7-F  [DIOM5226X240N]
D23  SMBJ30A-TR  [DIOM5436X244N]
F1  0154005.DR  [Littlefuse_154]
R109#1  DNP  [R_1206_TE-DNP]  (no BOM)
R110#1  0R  [R_1206_TE]
R172  47k  [R_0603_TE]
R173  47k  [R_0603_TE]
R219  47k  [R_0603_TE]
R220  47k  [R_0603_TE]
T8  DMP4015SSS-13  [SOIC127P600X175-8N]
T11  DMP4015SSS-13  [SOIC127P600X175-8N]
X14  1757242  [1757242]
X15  IPL1-102-02-L-D-K  [IPL1-102-02-L-D-K]

### Ports
VIN_Unprotected (out)

### Nets
GND: C145.1 C146.1 C147.1 D23.2(ANODE) R173.1 R220.1 X14.2 X15.1 X15.2
VIN: C107.1 C145.2 C146.2 C147.2 D22.2(K) D23.1(KATHODE) R172.2 T8.1(SOURCE) T8.2(SOURCE) T8.3(SOURCE) X15.3 X15.4
T8_D: F1.2 T8.5(DRAIN) T8.6(DRAIN) T8.7(DRAIN) T8.8(DRAIN)
T11_D: F1.1 R109#1.2 T11.5(DRAIN) T11.6(DRAIN) T11.7(DRAIN) T11.8(DRAIN)
T11_S: C121.1 R110#1.1 R219.2 T11.1(SOURCE) T11.2(SOURCE) T11.3(SOURCE) X14.1
VIN_Unprotected: R109#1.1 R110#1.2 ; port VIN_Unprotected
NetC107_2: C107.2 D22.1(A) R172.1 R173.2 T8.4(GATE)
NetC121_2: C121.2 R219.1 R220.2 T11.4(GATE)

### Layout directives
net class PWR: T8_D, T11_D, T11_S, VIN

### Notes on the sheet
- Switch on current limitation
- Short Circuit Protection
- Reverse Polarity Protection
- Overvoltage Protection
- VIN = 12..24 V
- Title
- Revision:
- Design Engineer:
- Date:
- Project:
- Sheet
- of

### Library data of the parts
C107 = UZgen_C_0603_100nF_50V_X7R: as C45 on sheet Power_Supply_1; Value: 100 nF; Technology: X7R; Manufacturer Part Number: UZgen_C_0603_100nF_50V_X7R; PartID: 1; Created On: 02/07/2024 14:42:23; Device Package: 0603; Mounting Type: SMD; Last Updated: 02/08/2024 14:45:57
C121 C145-C147 = UZgen_C_1206_10uF_50V_X7R: as C41 on sheet Power_Supply_1; Value: 10 µF; Manufacturer Part Number: UZgen_C_1206_10uF_50V_X7R; PartID: 5807; Created On: 20/03/2025 14:05:00; Device Package: 1206; Last Updated: 20/03/2025 14:05:00; Mounting Type: SMD; Technology: X7R
D22 = MMSZ5242B-7-F: Zener Diode, 12V, 500 mW; Manufacturer: Diodes Incorporated; Power: 0.5W; Power Loss: 500mW; Zener Impedance: 30 Ohm; Created from: MGremer; Category: zener; Manufacturer Part Number: MMSZ5242B-7-F; Package: SOD-123; Supplier: Mouser; Supplier Part Number 1: 621-MMSZ5242B-F; Mounting Style: SMT; Pins: 2; Voltage: 12V; PartID: 3; Created On: 06/01/2021 09:28:59; ComponentLink1Description: Datasheet; ComponentLink1URL: https://www.mouser.de/datasheet/2/115/DIOD_S_A0003550771_1-2542306.pdf; Component Type: Zener Diode; Device Package: SOD-123-2; Last Updated: 11/07/2024 09:34:11; Mounting Type: SMD; Operating Temperature: -65 - 150 °C; Series: MMSZ524; Supplier 1: Mouser; Type: Zener Diode; Value: 12V; Live Cycle Status: 1; Stock number: not stored; LCSC Part Number: C500776
D23 = SMBJ30A-TR: TVS Diode 30V 600W SMB unidirectional / ESD suppressor; Manufacturer: STMicroelectronics; Type: TVS-Diode; Created from: PBaumann; Manufacturer Part Number: SMBJ30A-TR; PartID: 19; Created On: 05/03/2021 11:12:07; ComponentLink1Description: Datasheet; ComponentLink1URL: https://www.st.com/resource/en/datasheet/smbj30a.pdf; Component Type: TVS Diode; Device Package: DO-214AA-2; Last Updated: 23/07/2025 19:13:45; Mounting Type: SMD; Operating Temperature: -55 - 150°C; Series: SMBJxxA; Supplier 1: LCSC; Supplier Part Number 1: C133663; Value: 30V; Live Cycle Status: 1; LCSC Part Number: C133663
F1 = 0154005.DR: Fuse OMNI BLOK 154; Manufacturer: Littlefuse; Nominal current: 5 A; Nominal voltage AC: 125 VAC; Nominal voltage DC: 125 VDC; Resistance: 12.5 mOhm; Value: 5 A; Created from: MGremer; Manufacturer Part Number: 0154005.DR; PartID: 1; Created On: 07/01/2021 10:17:19; ComponentLink1Description: Datasheet; ComponentLink1URL: https://www.mouser.de/datasheet/2/240/Littelfuse_Fuse_154_154T_154L_154TL_Datasheet_pdf-365375.pdf; Component Type: NAN02 - 154 OMNI-BLOK; Device Package: OMNI-BLOK; Last Updated: 04/09/2024 15:44:00; Mounting Type: SMD; Operating Temperature: -55 - 125 °C; Series: 154; Supplier 1: Mouser; Supplier Part Number 1: 576-0154005.DR; Type: Fuse; Live Cycle Status: 1; Supplier 2: LCSC; Supplier Part Number 2: C206916; LCSC Part Number: C206916
R109#1 = UZgen_R_1206_DNP: as R139Y on sheet Power_Supply_2; Manufacturer Part Number: UZgen_R_1206_DNP; PartID: 595; Created On: 25/03/2025 14:26:15; Value: DNP; Device Package: 1206; Tolerance: -; Mounting Type: SMD; Last Updated: 02/04/2025 19:05:00
R110#1 = UZgen_R_1206_0R: as R221-R224 on sheet Power_Supply_1; Manufacturer Part Number: UZgen_R_1206_0R; PartID: 583; Created On: 08/07/2024 14:34:30; Value: 0R; Device Package: 1206; Mounting Type: SMD; Last Updated: 08/07/2024 14:34:30
R172 R173 R219 R220 = UZgen_R_0603_47k: Generic resistor; Manufacturer: UZgen; Tolerance: 1 %; Created from: UZgenTool; Value: 47k; Manufacturer Part Number: UZgen_R_0603_47k; PartID: 260; Created On: 02.07.2024 17:29:50; Device Package: 0603; Mounting Type: SMD; Last Updated: 02.07.2024 17:29:50
T8 T11 = DMP4015SSS-13: MOSFET MOSFET BVDSS: 41V-60 1V-60V SO-8 T&R 2.5K; Manufacturer: Diodes Incorporated; Type: P-Channel Power MOSFET; Number Of Channels: 1; Drain Source Voltage: 40 V; Drain DC Current: 10.1 A; RDS On Resistance: 11 mOhm; Power Dissipation: 1.82 W; Value: 40 V; Created from: FRosner; Manufacturer Part Number: DMP4015SSS-13; PartID: 2; Created On: 28.06.2024 09:26:52; ComponentLink1Description: Datasheet; ComponentLink1URL: https://www.diodes.com/assets/Datasheets/DMP4015SSS.pdf; Component Type: MOSFET SO-8; Device Package: SOIC-8; Last Updated: 09.07.2024 20:11:46; Mounting Type: SMD; Operating Temperature: -55 - 150 °C; Series: DMP40; Supplier 1: Mouser; Supplier Part Number 1: 621-DMP4015SSS-13; Supplier 2: LCSC; Supplier Part Number 2: C508210; Live Cycle Status: 1; LCSC Part Number: C508210
X14 = 1757242: Pluggable Terminal Blocks 2 Pos 5.08mm pitch Through Hole Header; Manufacturer: Phoenix Contact; Created from: FRosner; Number of positions: 2; Manufacturer Part Number: 1757242; PartID: 58; Created On: 20/04/2023 12:39:10; ComponentLink1Description: Datasheet; ComponentLink1URL: https://wmsc.lcsc.com/wmsc/upload/file/pdf/v2/lcsc/1811051310_Phoenix-Contact-1757242_C90074.pdf; Component Type: Phoenix Connector; Device Package: Connector; Last Updated: 04/07/2024 08:41:38; Mounting Type: THT; Operating Temperature: -40 - 100  °C; Supplier 1: Mouser; Supplier Part Number 1: 651-1757242; Supplier 2: LCSC; Supplier Part Number 2: C90074; Type: Connector; Live Cycle Status: 1; Number of rows: 1; LCSC Part Number: C90074; Stock number: not stored
X15 = 30759: AN: 30759; Mixed: SMT; H-ART: IPL1-102-02-L-D-K-TR; Temperature-Range: -55/+125; Extra: Connector Header IPL1, 2-row 4pos, key polarization, SMT 0°; Case: IPL1; HelpURL: b:\AD\adlib\datasheet\Samtec\IPL1-SMT\

## Sheet Block_Diagram.SchDoc
size A4; PageSetup: Record=PageOptions|CenterHorizontal=True|CenterVertical=True|PrintScale=0.92|XCorrection=1.00|YCorrection=1.00|PrintKind=0|BorderSize=5000000|LeftOffset=0|BottomOffset=0|Orientation=2|PaperLength=1000|PaperWidth=1000|Scale=100|PaperSource=7|PrintQuality=-4|MediaType=1|DitherType=10|PrintScaleMode=1|PaperKind=A4; Author: A. Geiger & E. Liegmann; CompanyName: Technische Hochschule Nürnberg Georg Simon Ohm; Organization: UltraZohm; Address1: Kesslerplatz 12; Address2: 90489 Nürnberg; Address3: GERMANY; SheetNumber: 41; Website: www.ultrazohm.com
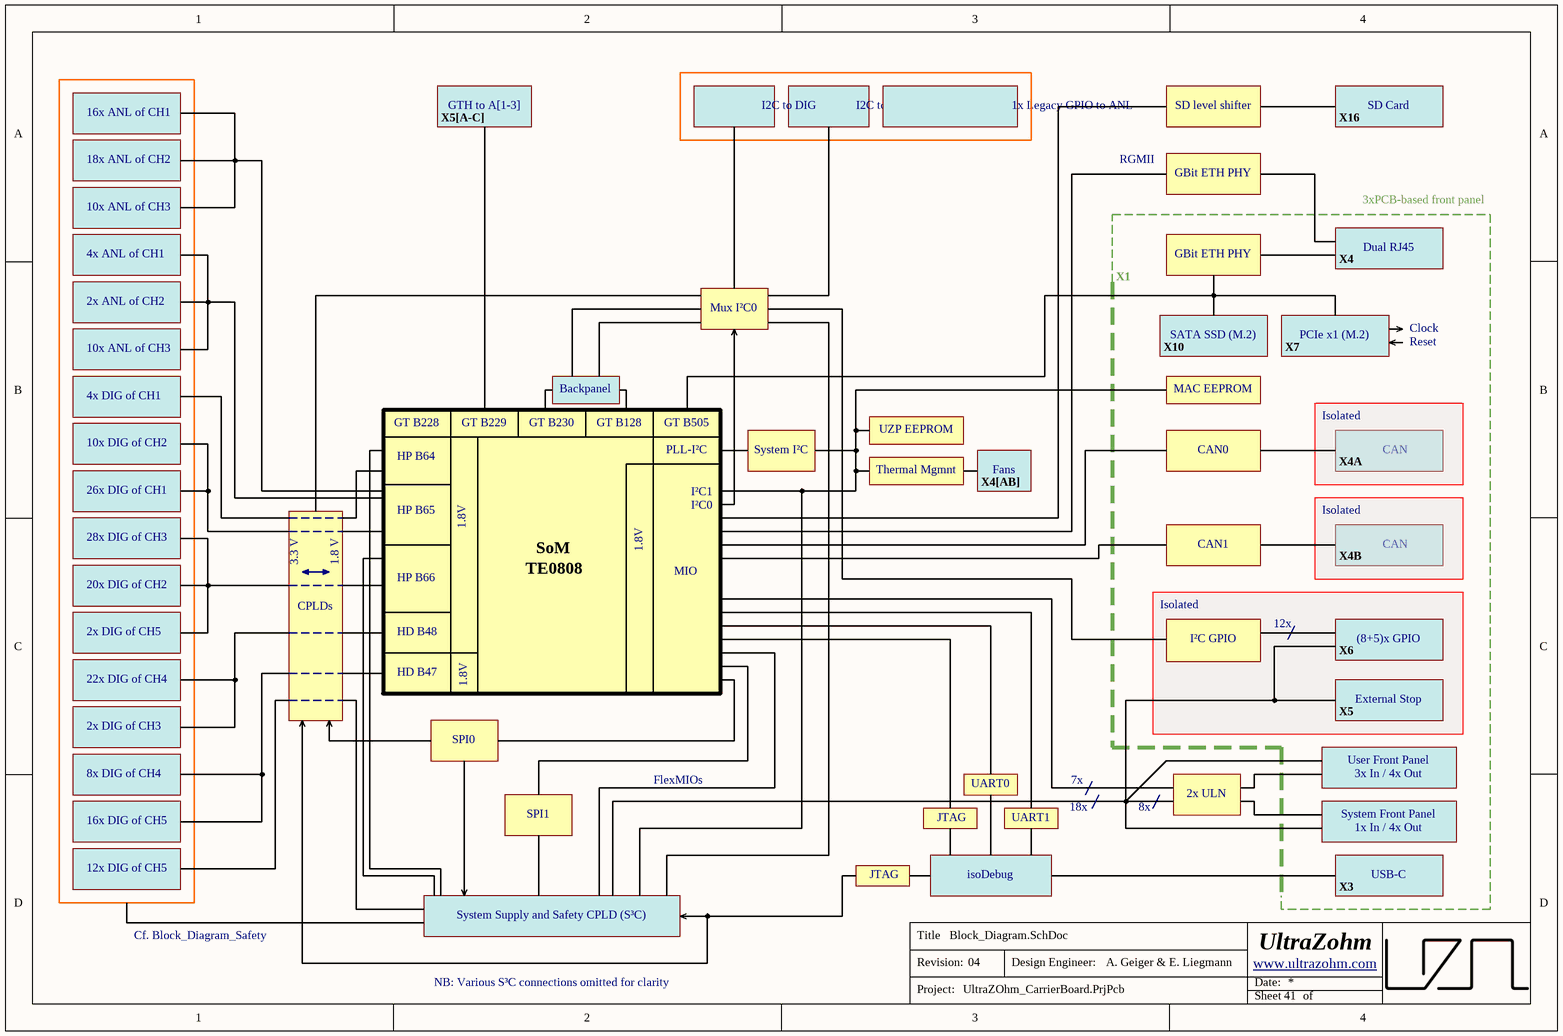
[diagram p10: Block_Diagram.SchDoc]

### Notes on the sheet
- 16x ANL of CH1
- GTH to A[1-3]
- I2C to DIG
- I2C to ANL
- 1x Legacy GPIO to ANL
- SD level shifter
- SD Card
- 18x ANL of CH2
- X5[A-C]
- RGMII
- GBit ETH PHY
- X16
- 10x ANL of CH3
- 3xPCB-based front panel
- Dual RJ45
- 4x ANL of CH1
- 2x ANL of CH2
- Mux I²C0
- X1
- X4
- X10
- SATA SSD (M.2)
- X7
- PCIe x1 (M.2)
- Clock
- Reset
- 4x DIG of CH1
- 10x DIG of CH2
- GT B228
- GT B229
- GT B230
- Backpanel
- GT B128
- GT B505
- UZP EEPROM
- MAC EEPROM
- Isolated
- 26x DIG of CH1
- HP B64
- HP B65
- PLL-I²C
- I²C1
- I²C0
- System I²C
- Thermal Mgmnt
- X4[AB]
- Fans
- CAN0
- X4A
- CAN
- 28x DIG of CH3
- 3.3 V
- 1.8 V
- HP B66
- 1.8V
- TE0808
- SoM
- MIO
- CAN1
- X4B
- 20x DIG of CH2
- 2x DIG of CH5
- CPLDs
- HD B48
- I²C GPIO
- 12x
- X6
- (8+5)x GPIO
- 22x DIG of CH4
- HD B47
- X5
- External Stop
- 8x DIG of CH4
- 2x DIG of CH3
- SPI0
- FlexMIOs
- UART0
- 7x
- User Front Panel
- 3x In / 4x Out
- 16x DIG of CH5
- SPI1
- JTAG
- UART1
- 18x
- 8x
- 2x ULN
- System Front Panel
- 1x In / 4x Out
- 12x DIG of CH5
- System Supply and Safety CPLD (S³C)
- isoDebug
- X3
- USB-C
- Cf. Block_Diagram_Safety
- NB: Various S³C connections omitted for clarity
- Title
- Revision:
- Design Engineer:
- Date:
- Project:
- Sheet
- of